# EasyEDA Pro project ProPrj_VFD_DynoClock_ESP32_2025-04-16.epro, schematic Schematic1_1
Board Name: Board1; Create Date: 2025-03-25; Page Name: main board; Project Name: VFD_DynoClock_ESP32; Schematic Name: Schematic1; Update Date: 2025-03-26; Company: EasyEDA.com; Drawn: EasyEDA; Page Size: A4; Part Number: JLCPCB-002; Reviewed: EasyEDA; Version: V0.1
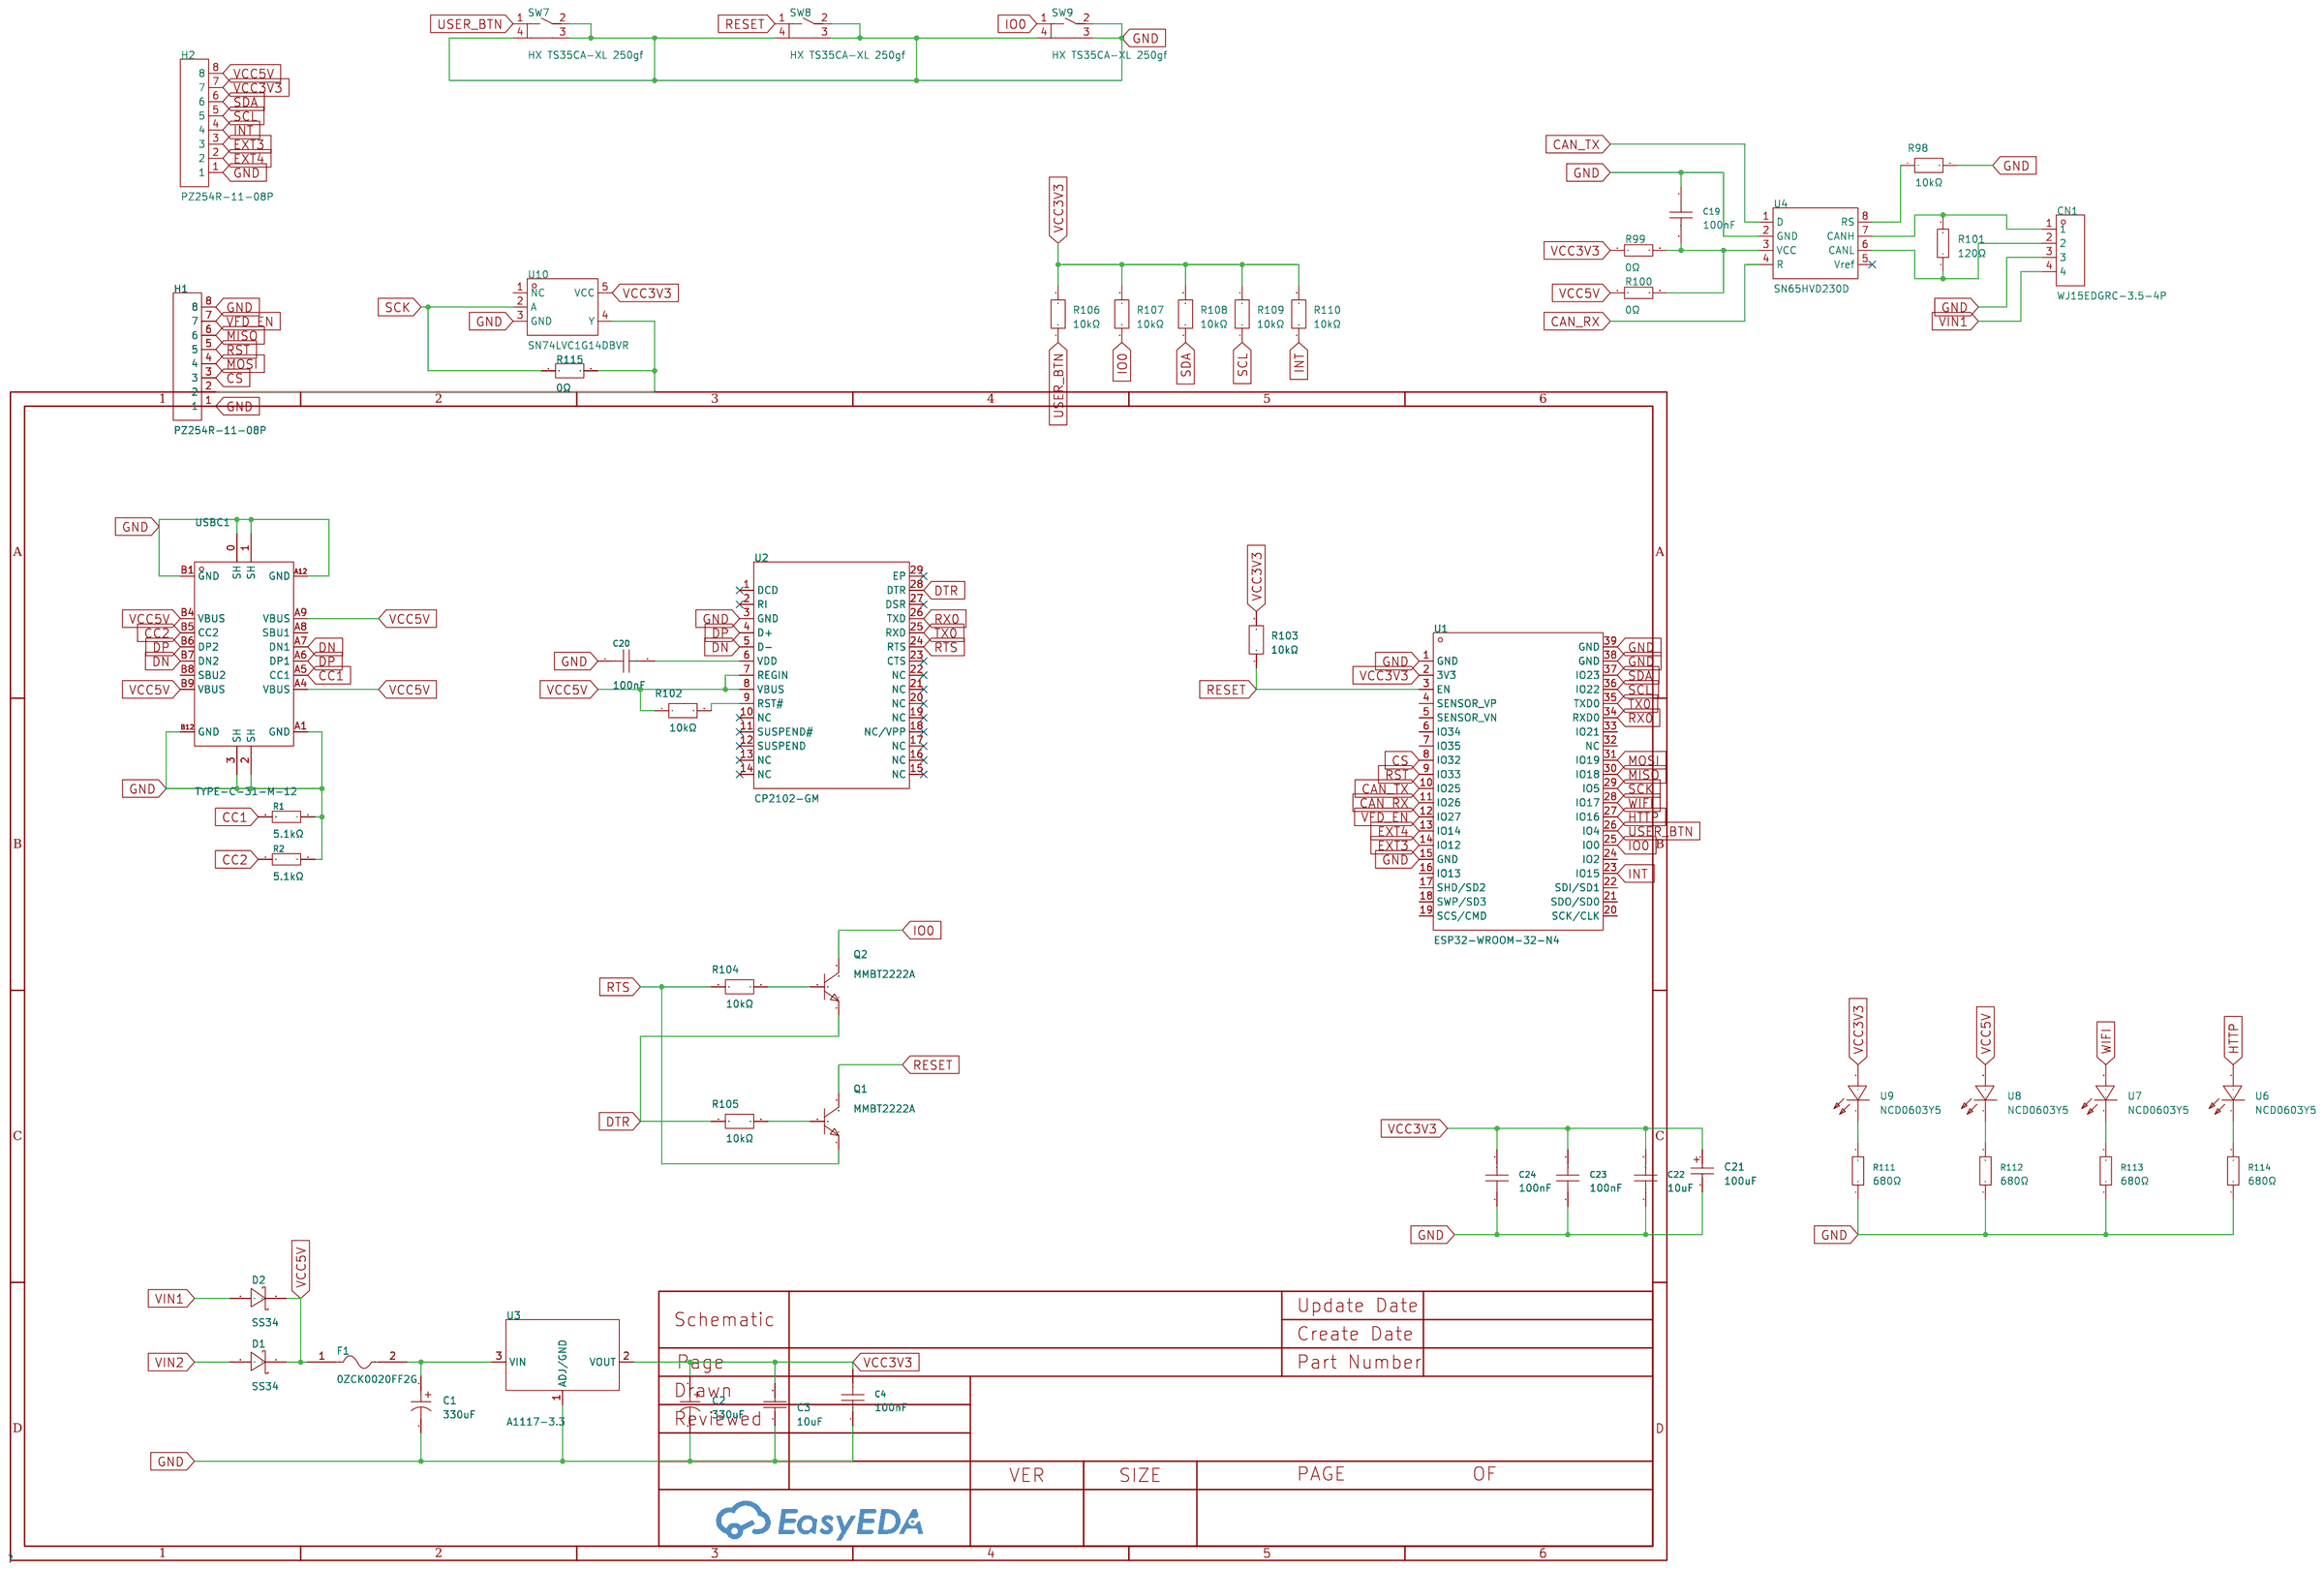
[diagram p0: schematic sheet]

## Parts
C1  330uF  [CAP-SMD_BD6.3-L6.6-W6.6-LS7.4-FD]
C2  330uF  [CAP-SMD_BD6.3-L6.6-W6.6-LS7.4-FD]
C3  10uF  [C1206]
C4  100nF  [C0603]
C19  100nF  [C0603]
C20  100nF  [C0603]
C21  100uF  [CASE-B_3528]
C22  10uF  [C1206]
C23  100nF  [C0603]
C24  100nF  [C0603]
CN1  WJ15EDGRC-3.5-4P  [CONN-TH_4P-P3.50_WJ15EDGRC-3.5]
D1  SS34  [SMA_L4.3-W2.6-LS5.2-RD]
D2  SS34  [SMA_L4.3-W2.6-LS5.2-RD]
F1  0ZCK0020FF2G  [F0805]
H1  PZ254R-11-08P  [HDR-TH_8P-P2.54-H-M-W10.4]
H2  PZ254R-11-08P  [HDR-TH_8P-P2.54-H-M-W10.4]
Q1  MMBT2222A  [SOT-23_L2.9-W1.3-P1.90-LS2.4-BR]
Q2  MMBT2222A  [SOT-23_L2.9-W1.3-P1.90-LS2.4-BR]
R1  5.1kΩ  [R0603]
R2  5.1kΩ  [R0603]
R98  10kΩ  [R0603]
R99  0Ω  [R0603]
R100  0Ω  [R0603]
R101  120Ω  [R0603]
R102  10kΩ  [R0603]
R103  10kΩ  [R0603]
R104  10kΩ  [R0603]
R105  10kΩ  [R0603]
R106  10kΩ  [R0603]
R107  10kΩ  [R0603]
R108  10kΩ  [R0603]
R109  10kΩ  [R0603]
R110  10kΩ  [R0603]
R111  680Ω  [R0603]
R112  680Ω  [R0603]
R113  680Ω  [R0603]
R114  680Ω  [R0603]
R115  0Ω  [R0603]
SW7  HX TS35CA-XL 250gf  [KEY-SMD_HX-TS35CA-250GF]
SW8  HX TS35CA-XL 250gf  [KEY-SMD_HX-TS35CA-250GF]
SW9  HX TS35CA-XL 250gf  [KEY-SMD_HX-TS35CA-250GF]
U1  ESP32-WROOM-32-N4  [WIFIM-SMD_ESP32-WROOM-32-N4]
U2  CP2102-GM  [QFN-28_L5.0-W5.0-P0.50-TL-EP3.2]
U3  A1117-3.3  [SOT-223-3_L6.5-W3.4-P2.30-LS7.0-BR-1]
U4  SN65HVD230D  [SOIC-8_L4.9-W3.9-P1.27-LS6.0-BL]
U6  NCD0603Y5  [LED0603-RD]
U7  NCD0603Y5  [LED0603-RD]
U8  NCD0603Y5  [LED0603-RD]
U9  NCD0603Y5  [LED0603-RD]
U10  SN74LVC1G14DBVR  [SOT-23-5_L3.0-W1.7-P0.95-LS2.8-BR]
USBC1  TYPE-C-31-M-12  [USB-C_SMD-TYPE-C-31-M-12]

## Library data of the parts
C1 C2 = RVT0J331M0605: Capacitance: Tolerance:±20% Tolerance:±20% Voltage Rating: Ripple Current:95mA@120Hz Diameter: Height - Seated (Max): Lifetime:2000hrs@105℃ Operating Temperature:-40℃~+105℃ Operating Temperature:-40℃~+105℃; LCSC Part Name: 330uF ±20% 6.3V; Supplier Part: C2999060; Manufacturer: ROQANG(容强); Supplier Footprint: SMD,D6.3xL5.4mm; JLCPCB Part Class: Extended Part; Datasheet: https://atta.szlcsc.com/upload/public/pdf/source/20170325/1490427950282.pdf; Supplier: LCSC; Tolerance: ±20%; Ripple Current: 95mA@120Hz; Lifetime: 2000hrs@105℃; Operating Temperature: -40℃~+105℃
C3 = CL31A106KBHNNNE: Capacitance: Tolerance:±10% Tolerance:±10% Voltage Rated: Temperature Coefficient:; LCSC Part Name: 10uF ±10% 50V; Supplier Part: C13585; Manufacturer: SAMSUNG(三星); Supplier Footprint: 1206; JLCPCB Part Class: Basic Part; Datasheet: https://atta.szlcsc.com/upload/public/pdf/source/20160218/1457707763339.pdf; Supplier: LCSC; Tolerance: ±10%
C4 C19 C20 C23 C24 = CC0603KRX7R9BB104: Capacitance: Tolerance:±10% Tolerance:±10% Voltage Rated: Temperature Coefficient:; LCSC Part Name: 100nF ±10% 50V; Supplier Part: C14663; Manufacturer: YAGEO(国巨); Supplier Footprint: 0603; JLCPCB Part Class: Basic Part; Datasheet: https://atta.szlcsc.com/upload/public/pdf/source/20180910/C282072_33301C7F631E79921B82A8DAC6BCC5B3.pdf; Supplier: LCSC; Tolerance: ±10%
C21 = TAJB107K006RNJ: Capacitance: Tolerance:±10% Tolerance:±10% Rated Voltage: Equivalent Series Resistance(ESR):1.7Ω@100kHz Operating Temperature:-55℃~+125℃ Operating Temperature:-55℃~+125℃; LCSC Part Name: 100uF ±10% 6.3V; Supplier Part: C16133; Manufacturer: Kyocera AVX; Supplier Footprint: CASE-B-3528-21(mm); JLCPCB Part Class: Basic Part; Datasheet: https://atta.szlcsc.com/upload/public/pdf/source/20160107/1457707750344.pdf; Supplier: LCSC; Tolerance: ±10%; Equivalent Series Resistance(ESR): 1.7Ω@100kHz; Operating Temperature: -55℃~+125℃
C22 = CL31B106KAHNNNE: Capacitance: Tolerance:±10% Tolerance:±10% Voltage Rated: Temperature Coefficient:; LCSC Part Name: 10uF ±10% 25V; Supplier Part: C14860; Manufacturer: SAMSUNG(三星); Supplier Footprint: 1206; JLCPCB Part Class: Extended Part; Datasheet: https://atta.szlcsc.com/upload/public/pdf/source/20160218/1457707763339.pdf; Supplier: LCSC; Tolerance: ±10%
CN1 = WJ15EDGRC-3.5-4P: Connector Type:Receptacle-Close fixed form:- Structure:1x4P Pitch:3.5mm Color:- Mounting Style:Bend Number of Pins:4P Number of Rows:1 Number of PINs Per Row:4 Current Rating (Max):8A Voltage Rating (Max):300V Wire Gauge - AWG:- Wire Gauge - AWG:- Wire Ga; LCSC Part Name: 1x4P 3.5mm 排数:1 每排P数:4; Supplier Part: C5241865; Manufacturer: KANGNEX(康奈克斯电气); Supplier Footprint: 弯插,P=3.5mm; JLCPCB Part Class: Extended Part; Datasheet: https://atta.szlcsc.com/upload/public/pdf/source/20221116/50019F1EE6DFE3EDCC35A52D7A721DB2.pdf; Supplier: LCSC; Connector Type: Receptacle-Close; Structure: 1x4P; Pitch: 3.5mm; Mounting Style: Bend; Number of Pins: 4P; Number of Rows: 1; Number of PINs Per Row: 4; Current Rating (Max): 8A; Voltage Rating (Max): 300V; Contact Material: Brass; Contact Plating: Tin; Operating Temperature Range: -40℃~+105℃
D1 D2 = SS34_C8678: Diode Configuration:Independent Type Forward Voltage (Vf@If):550mV@3A Reverse Voltage (Vr):40V Rectified Current:3A Reverse Leakage Current (Ir):500uA@40V; LCSC Part Name: 电压:40V 电流:3A; Supplier Part: C8678; Manufacturer: MDD(辰达半导体); Supplier Footprint: SMA(DO-214AC); JLCPCB Part Class: Basic Part; Datasheet: https://atta.szlcsc.com/upload/public/pdf/source/20240710/2118BB86FDDB2E0B294389AC1F3F65C8.pdf; Supplier: LCSC; Diode Configuration: Independent Type; Forward Voltage (Vf@If): 550mV@3A; Reverse Voltage (Vr): 40V; Rectified Current: 3A; Reverse Leakage Current (Ir): 500uA@40V
F1 = 0ZCK0020FF2G: Voltage - Max:9V Current - Max:100A Hold Current:200mA Trip Current:500mA Resistance - Initial (Ri) (Min):400mΩ Resistance - Post Trip (R1) (Max):3.5Ω Time to Trip(Max):20ms Operating Temperature:-40℃~+85℃ Operating Temperature:-40℃~+85℃; LCSC Part Name: 9V 200mA 自恢复; Supplier Part: C3760282; Manufacturer: belfuse; Supplier Footprint: 0805; JLCPCB Part Class: Extended Part; Datasheet: https://atta.szlcsc.com/upload/public/pdf/source/20230904/4B09CCBBB302D10BB9BDC38B709AD03A.pdf; Supplier: LCSC; Voltage - Max: 9V; Current - Max: 100A; Hold Current: 200mA; Trip Current: 500mA; Resistance - Initial (Ri) (Min): 400mΩ; Resistance - Post Trip (R1) (Max): 3.5Ω; Time to Trip(Max): 20ms; Operating Temperature: -40℃~+85℃
H1 H2 = PZ254R-11-08P: Pin Structure:1x8P Pitch:2.54mm Row Spacing:- Circluar Pins/Square Pins:Policy Mounting Type:Right-Angle Number of Rows:Single Row Number of Pins:8P Current Rating:- Voltage Rating (Max):- Length of Mating Pin:6mm Insulation Height:2.5mm Contact Material:; LCSC Part Name: 1x8P 间距:2.54mm 方针 弯插; Supplier Part: C492416; Manufacturer: XFCN(兴飞); Supplier Footprint: 弯插,P=2.54mm; JLCPCB Part Class: Extended Part; Datasheet: https://atta.szlcsc.com/upload/public/pdf/source/20200309/C492416_50F53578DC639C00894E1D796EC334D3.pdf; Supplier: LCSC; Pin Structure: 1x8P; Pitch: 2.54mm; Circluar Pins/Square Pins: Policy; Mounting Type: Right-Angle; Number of Rows: Single Row; Number of Pins: 8P; Length of Mating Pin: 6mm; Insulation Height: 2.5mm; Contact Material: Brass; Operating Temperature: -40℃~+105℃; Color: Black
Q1 Q2 = MMBT2222A_C2992465: Supplier Part: C2992465; Manufacturer: PANJIT(强茂); Supplier Footprint: SOT-23; JLCPCB Part Class: Extended Part; Datasheet: https://atta.szlcsc.com/upload/public/pdf/source/20220412/C8605CF75378829D36303CC76FBF46AE.pdf; Supplier: LCSC
R1 R2 = 0603WAF5101T5E: Type:Thick Film Resistors Resistance:5.1kΩ Tolerance:±1% Tolerance:±1% Power(Watts): Overload Voltage (Max): Temperature Coefficient:±100ppm/℃ Temperature Coefficient:±100ppm/℃ Operating Temperature Range:-55℃~+155℃ Operating Temperature Range:-55℃~+155℃; LCSC Part Name: 5.1kΩ ±1% 100mW 厚膜电阻; Supplier Part: C23186; Manufacturer: UNI-ROYAL(厚声); Supplier Footprint: 0603; JLCPCB Part Class: Basic Part; Datasheet: https://atta.szlcsc.com/upload/public/pdf/source/20200306/C422600_1E6D84923E4A46A82E41ADD87F860B5C.pdf; Supplier: LCSC; Type: Thick Film Resistors; Tolerance: ±1%; Temperature Coefficient: ±100ppm/℃; Operating Temperature Range: -55℃~+155℃
R98 R102-R110 = FRC0603J103TS: Type:Thick Film Resistors Resistance:10kΩ Tolerance:±5% Tolerance:±5% Power(Watts): Overload Voltage (Max): Temperature Coefficient:±100ppm/℃ Temperature Coefficient:±100ppm/℃ Operating Temperature Range:-55℃~+155℃ Operating Temperature Range:-55℃~+155℃; LCSC Part Name: 10kΩ ±5% 100mW 厚膜电阻; Supplier Part: C2930027; Manufacturer: FOJAN(富捷); Supplier Footprint: 0603; JLCPCB Part Class: Extended Part; Datasheet: https://atta.szlcsc.com/upload/public/pdf/source/20211221/925EC7D7225764EE0046F22065062C87.pdf; Supplier: LCSC; Type: Thick Film Resistors; Tolerance: ±5%; Temperature Coefficient: ±100ppm/℃; Operating Temperature Range: -55℃~+155℃
R99 R100 = 0603WAF0000T5E: Type:Thick Film Resistors Resistance: Tolerance:±1% Tolerance:±1% Power(Watts): Overload Voltage (Max): Operating Temperature Range:-55℃~+155℃ Operating Temperature Range:-55℃~+155℃; LCSC Part Name: 0Ω ±1% 100mW 厚膜电阻; Supplier Part: C21189; Manufacturer: UNI-ROYAL(厚声); Supplier Footprint: 0603; JLCPCB Part Class: Basic Part; Datasheet: https://atta.szlcsc.com/upload/public/pdf/source/20200306/C422600_1E6D84923E4A46A82E41ADD87F860B5C.pdf; Supplier: LCSC; Type: Thick Film Resistors; Tolerance: ±1%; Operating Temperature Range: -55℃~+155℃
R101 = RC0603FR-07120RL: Type:Thick Film Resistors Resistance: Tolerance:±1% Tolerance:±1% Power(Watts): Overload Voltage (Max): Temperature Coefficient:±100ppm/℃ Temperature Coefficient:±100ppm/℃ Operating Temperature Range:-55℃~+155℃ Operating Temperature Range:-55℃~+155℃; LCSC Part Name: 厚膜电阻 120Ω ±1% 100mW; Supplier Part: C114640; Manufacturer: YAGEO(国巨); Supplier Footprint: 0603; JLCPCB Part Class: Extended Part; Datasheet: https://atta.szlcsc.com/upload/public/pdf/source/20180821/C275644_0D56F95EFF785E7D9A1FEF436B37DA78.pdf; Supplier: LCSC; Type: Thick Film Resistors; Tolerance: ±1%; Temperature Coefficient: ±100ppm/℃; Operating Temperature Range: -55℃~+155℃
R111-R114 = 0603WAF6800T5E: Type:Thick Film Resistors Resistance: Tolerance:±1% Tolerance:±1% Power(Watts): Overload Voltage (Max): Temperature Coefficient:±100ppm/℃ Temperature Coefficient:±100ppm/℃ Operating Temperature Range:-55℃~+155℃ Operating Temperature Range:-55℃~+155℃; LCSC Part Name: 680Ω ±1% 100mW 厚膜电阻; Supplier Part: C23228; Manufacturer: UNI-ROYAL(厚声); Supplier Footprint: 0603; JLCPCB Part Class: Basic Part; Datasheet: https://atta.szlcsc.com/upload/public/pdf/source/20200306/C422600_1E6D84923E4A46A82E41ADD87F860B5C.pdf; Supplier: LCSC; Type: Thick Film Resistors; Tolerance: ±1%; Temperature Coefficient: ±100ppm/℃; Operating Temperature Range: -55℃~+155℃
R115 = FRC0603P000 TS: Type:Thick Film Resistors Resistance: Tolerance:±5% Tolerance:±5% Power(Watts): Overload Voltage (Max): Operating Temperature Range:-55℃~+155℃ Operating Temperature Range:-55℃~+155℃; LCSC Part Name: 0Ω ±5% 100mW 厚膜电阻; Supplier Part: C2907080; Manufacturer: FOJAN(富捷); Supplier Footprint: 0603; JLCPCB Part Class: Extended Part; Datasheet: https://atta.szlcsc.com/upload/public/pdf/source/20211221/925EC7D7225764EE0046F22065062C87.pdf; Supplier: LCSC; Type: Thick Film Resistors; Tolerance: ±5%; Operating Temperature Range: -55℃~+155℃
SW7-SW9 = HX TS35CA-XL 250gf: Actuator Style:Round Button Operating Force:2.5N Mounting Type:Horizontal attachment Length:- Width:3.3mm Switch Height:3.4mm Strike Gundam:- Contact Current:50mA Voltage Rating:12V Actuator/Cap Color:White With Lamp:None IP Rating:- Termination Style:SMD; LCSC Part Name: 轻触开关4.5*3.8*3.5mm 卧贴笑脸开关侧按250gf; Supplier Part: C36498970; Manufacturer: hanxia(韩下); Supplier Footprint: SMD,3x5mm; JLCPCB Part Class: Extended Part; Datasheet: https://atta.szlcsc.com/upload/public/pdf/source/20241121/A424BFD2631ED41B3C2F6AC58D0F5B17.pdf; Supplier: LCSC; Actuator Style: Round Button; Operating Force: 2.5N; Mounting Type: Horizontal attachment; Width: 3.3mm; Switch Height: 3.4mm; Contact Current: 50mA; Voltage Rating: 12V; Actuator/Cap Color: White; With Lamp: None; Termination Style: SMDSplicing; Life: 100,000 Times; Operating Temperature: -25℃~+70℃
U1 = ESP32-WROOM-32-N4: LCSC Part Name: WiFi+蓝牙4.2+双核CPU模块; Supplier Part: C82899; Manufacturer: ESPRESSIF(乐鑫); Supplier Footprint: SMD,18x25.5mm; JLCPCB Part Class: Extended Part; Datasheet: https://atta.szlcsc.com/upload/public/pdf/source/20210719/C82899_2D52724B6FAFABC419BCF308C5944296.pdf; Supplier: LCSC
U2 = CP2102-GM: Applications Function:USB to UART Protocol:USB 2.0 Number of Channels:1 Voltage - Supply:3V~3.6V Voltage - Supply:3V~3.6V Data Rate:12Mbps Operating Temperature:-40℃~+85℃ Operating Temperature:-40℃~+85℃; LCSC Part Name: 单芯片USB转UART桥接控制器; Supplier Part: C430012; Manufacturer: SKYWORKS/SILICON LABS(芯科); Supplier Footprint: QFN-28-EP(5x5); JLCPCB Part Class: Extended Part; Datasheet: https://atta.szlcsc.com/upload/public/pdf/source/20190920/C430014_98A01585C07E39A29412843282533F6F.pdf; Supplier: LCSC; Applications Function: USB to UART; Protocol: USB 2.0; Number of Channels: 1; Voltage - Supply: 3V~3.6V; Data Rate: 12Mbps; Operating Temperature: -40℃~+85℃
U3 = A1117-3.3: Output Current:1A Features:热关断(TSD)；Overcurrent Protection(OCP); LCSC Part Name: AMS1117-3.3; Supplier Part: C7432020; Manufacturer: IDCHIP(英锐芯); Supplier Footprint: SOT-223; JLCPCB Part Class: Extended Part; Datasheet: https://atta.szlcsc.com/upload/public/pdf/source/20230625/435FEEFA02C0FE449E7397A11F8448E0.pdf; Supplier: LCSC; Output Current: 1A; Features: 热关断(TSD)；Overcurrent Protection(OCP)
U4 = SN65HVD230D: Type:CANtransceiver Data Rate:1Mbps Supply Voltage:3V~3.6V Supply Voltage:3V~3.6V Supply Current:17mA Operating Temperature:-40℃~+85℃ Operating Temperature:-40℃~+85℃; LCSC Part Name: SN65HVD230, SN65HVD231, SN65HVD232 3.3V CAN总线收发器; Supplier Part: C1543812; Manufacturer: TI(德州仪器); Supplier Footprint: SOIC-8; JLCPCB Part Class: Extended Part; Datasheet: https://www.ti.com/cn/lit/gpn/sn65hvd230; Supplier: LCSC; Type: CANtransceiver; Data Rate: 1Mbps; Supply Voltage: 3V~3.6V; Supply Current: 17mA; Operating Temperature: -40℃~+85℃
U6-U9 = NCD0603Y5: Emitted Color:Yellow Forward Voltage (VF):1.6V~2.6V Forward Voltage (VF):1.6V~2.6V Power Dissipation:65mW Forward Current:25mA Dominant Wavelength:586nm~595nm Dominant Wavelength:586nm~595nm Peak Wavelength:595nm Lens Color:无色透明透镜 Luminous Intensity:50mcd; Supplier Part: C7429912; Manufacturer: 国星光电; Supplier Footprint: 0603; JLCPCB Part Class: Extended Part; Datasheet: https://atta.szlcsc.com/upload/public/pdf/source/20230620/E066DC923D84CFEDAC0E449DF4E6AB68.pdf; Supplier: LCSC; Emitted Color: Yellow; Forward Voltage (VF): 1.6V~2.6V; Power Dissipation: 65mW; Forward Current: 25mA; Dominant Wavelength: 586nm~595nm; Peak Wavelength: 595nm; Lens Color: 无色透明透镜; Luminous Intensity: 50mcd~150mcd; Viewing Angle: 140°; Operating Temperature: -30℃~+85℃
U10 = SN74LVC1G14DBVR: Input Type:Schmitt Trigger Supply Voltage(Single):1.65V~5.5V Supply Voltage(Single):1.65V~5.5V Supply Current (Max):10uA Number of Circuits:1 Number of Inputs:1 Sink Current:32mA Source Current:32mA High level range (VIH):1V~3V High level range (VIH):1V~3; LCSC Part Name: 门极和反相器; Supplier Part: C434069; Manufacturer: UMW(友台半导体); Supplier Footprint: SOT-23-5; JLCPCB Part Class: Extended Part; Datasheet: https://atta.szlcsc.com/upload/public/pdf/source/20231109/6055D1B61DE2E899F5391931885BEAFC.pdf; Supplier: LCSC; Input Type: Schmitt Trigger; Supply Voltage(Single): 1.65V~5.5V; Supply Current (Max): 10uA; Number of Circuits: 1; Number of Inputs: 1; Sink Current: 32mA; Source Current: 32mA; High level range (VIH): 1V~3V; Low level range (VIL): 500mV~1.9V; Max Propagation Delay: 20ns@5V,15pF; Series: 74LVCSeries; Operating Temperature: -40℃~+105℃
USBC1 = TYPE-C-31-M-12: Connector Type:Type-C Standard:- Gender:Female Mounting Style:- Number of Contacts:16P Number of Ports:1 Current Rating - Power (Max):5A Operating Temperature Range:- Operating Temperature Range:-; LCSC Part Name: Type-C 母; Supplier Part: C165948; Manufacturer: 韩国韩荣; Supplier Footprint: SMD; JLCPCB Part Class: Extended Part; Datasheet: https://atta.szlcsc.com/upload/public/pdf/source/20220525/466408E853115E789EDB0DDC29077C05.pdf; Supplier: LCSC; Connector Type: Type-C; Gender: Female; Number of Contacts: 16P; Number of Ports: 1; Current Rating - Power (Max): 5A

## Nets
GND: C1.2 C2.2 C3.1 C4.1 C19.1 C20.1 C21.2 C22.1 C23.1 C24.1 CN1.3 H1.1 H1.8 H2.1 R1.1 R2.2 R98.2 R111.1 R112.1 R113.1 R114.1 SW7.2 SW7.3 SW7.4 SW8.2 SW8.3 SW8.4 SW9.2 SW9.3 SW9.4 U1.1(GND) U1.15(GND) U1.38(GND) U1.39(GND) U2.3(GND) U3.1(ADJ/GND) U4.2(GND) U10.3(GND) USBC1.0(SH) USBC1.1(SH) USBC1.2(SH) USBC1.3(SH) USBC1.A1(GND) USBC1.A12(GND) USBC1.B1(GND) USBC1.B12(GND)
VCC3V3: C2.1 C3.2 C4.2 C21.1 C22.2 C23.2 C24.2 H2.7 R99.1 R103.2 R106.2 R107.2 R108.2 R109.2 R110.2 U1.2(3V3) U3.2(VOUT) U9.2(+) U10.5(VCC)
VCC5V: D1.1(K) D2.1(K) F1.1 H2.8 R100.1 R102.1 U2.7(REGIN) U2.8(VBUS) U8.2(+) USBC1.A4(VBUS) USBC1.A9(VBUS) USBC1.B4(VBUS) USBC1.B9(VBUS)
VIN1: CN1.4 D2.2(A)
VIN2: D1.2(A)
CAN_RX: U1.11(IO26) U4.4(R)
CAN_TX: U1.10(IO25) U4.1(D)
CC1: R1.2 USBC1.A5(CC1)
CC2: R2.1 USBC1.B5(CC2)
CS: H1.3 U1.8(IO32)
DN: U2.5(D-) USBC1.A7(DN1) USBC1.B7(DN2)
DP: U2.4(D+) USBC1.A6(DP1) USBC1.B6(DP2)
DTR: Q2.2(E) R105.1 U2.28(DTR)
EXT3: H2.3 U1.14(IO12)
EXT4: H2.2 U1.13(IO14)
HTTP: U1.27(IO16) U6.2(+)
INT: H2.4 R110.1 U1.23(IO15)
IO0: Q2.3(C) R107.1 SW9.1 U1.25(IO0)
MISO: H1.6 U1.30(IO18)
MOSI: H1.4 U1.31(IO19)
RESET: Q1.3(C) R103.1 SW8.1 U1.3(EN)
RST: H1.5 U1.9(IO33)
RTS: Q1.2(E) R104.1 U2.24(RTS)
RX0: U1.34(RXD0) U2.26(TXD)
SCK: R115.1 U1.29(IO5) U10.2(A)
SCL: H2.5 R109.1 U1.36(IO22)
SDA: H2.6 R108.1 U1.37(IO23)
TX0: U1.35(TXD0) U2.25(RXD)
USER_BTN: R106.1 SW7.1 U1.26(IO4)
VFD_EN: H1.7 U1.12(IO27)
WIFI: U1.28(IO17) U7.2(+)
$1N1609: C1.1 F1.2 U3.3(VIN)
$1N3246: R98.1 U4.8(RS)
$1N3386: C19.2 R99.2 R100.2 U4.3(VCC)
$1N3572: CN1.1 R101.2 U4.7(CANH)
$1N3578: CN1.2 R101.1 U4.6(CANL)
$1N4140: R102.2 U2.9(RST#)
$1N4204: C20.2 U2.6(VDD)
$1N4780: Q2.1(B) R104.2
$1N4796: Q1.1(B) R105.2
$1N6694: H1.2 R115.2 U10.4(Y)
$1N7635: R111.2 U9.1(-)
$1N7639: R112.2 U8.1(-)
$1N7644: R113.2 U7.1(-)
$1N7649: R114.2 U6.1(-)

Not connected (* = marked no-connect by the designer): U1 4(SENSOR_VP) 5(SENSOR_VN) 6(IO34) 7(IO35) 16(IO13) 17(SHD/SD2) 18(SWP/SD3) 19(SCS/CMD) 20(SCK/CLK) 21(SDO/SD0) 22(SDI/SD1) 24(IO2) 32(NC) 33(IO21); U2 1(DCD)* 2(RI)* 10(NC)* 11(SUSPEND#)* 12(SUSPEND)* 13(NC)* 14(NC)* 15(NC)* 16(NC)* 17(NC)* 18(NC/VPP)* 19(NC)* 20(NC)* 21(NC)* 22(NC)* 23(CTS)* 27(DSR)* 29(EP)*; U4 5(Vref)*; U10 1(NC); USBC1 A8(SBU1) B8(SBU2)
